# EasyEDA schematic 4.95.json
TITLE: Sheet_1; REV: 1.0; Date: 2020-11-18; Sheet: 1/1; Drawn By: Gökbey Keskin; Company: Your Company
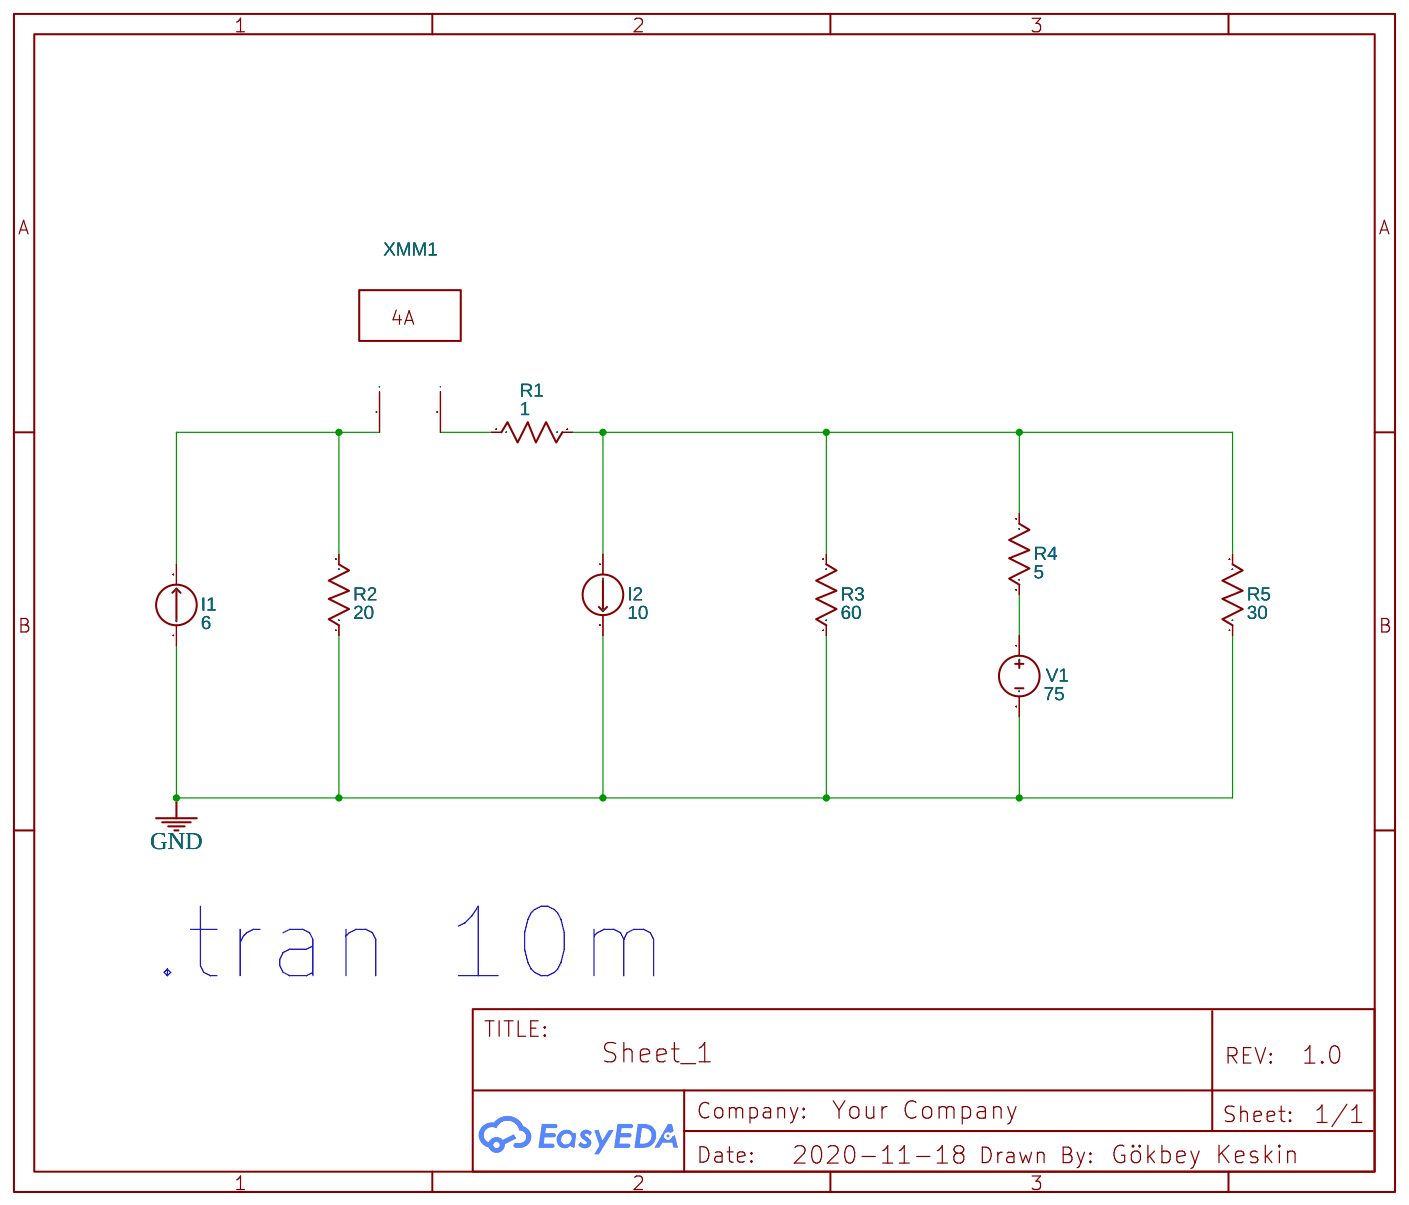
[diagram p0: schematic sheet]

## Parts
I1  6  [2P-5.08]
I2  10  [2P-5.08]
R1  1  [AXIAL-0.3]
R2  20  [AXIAL-0.3]
R3  60  [AXIAL-0.3]
R4  5  [AXIAL-0.3]
R5  30  [AXIAL-0.3]
V1  75  [HDR1X2]
XMM1  Multimeter

## Library data of the parts
I1 I2 = IDC: Contributor: EasyEDA; sim: true
R1-R5 = Resistor_US: Resistance: 1k; Contributor: EasyEDA; Supplier: YUJING
V1 = VDC: Contributor: EasyEDA; sim: true
XMM1 = MULTIMETER: Supplier: LCSC; Multimeter Type: Amper; Power Type: AC; Voltmeter resistance: 10μ; Ammeter resistance: 1G; NameDisplay: 0; Contributor: EasyEDA; sim: true

## Nets
GND: I1.1 I2.2 R2.1 R3.1 R5.1 V1.2
Net-(I1-2): I1.2 R2.2 XMM1.1(+)
Net-(I2-1): I2.1 R1.2 R3.2 R4.2 R5.2
Net-(R1-1): R1.1 XMM1.2(I)
Net-(R4-1): R4.1 V1.1

## Notes on the sheet
- .tran 10m
